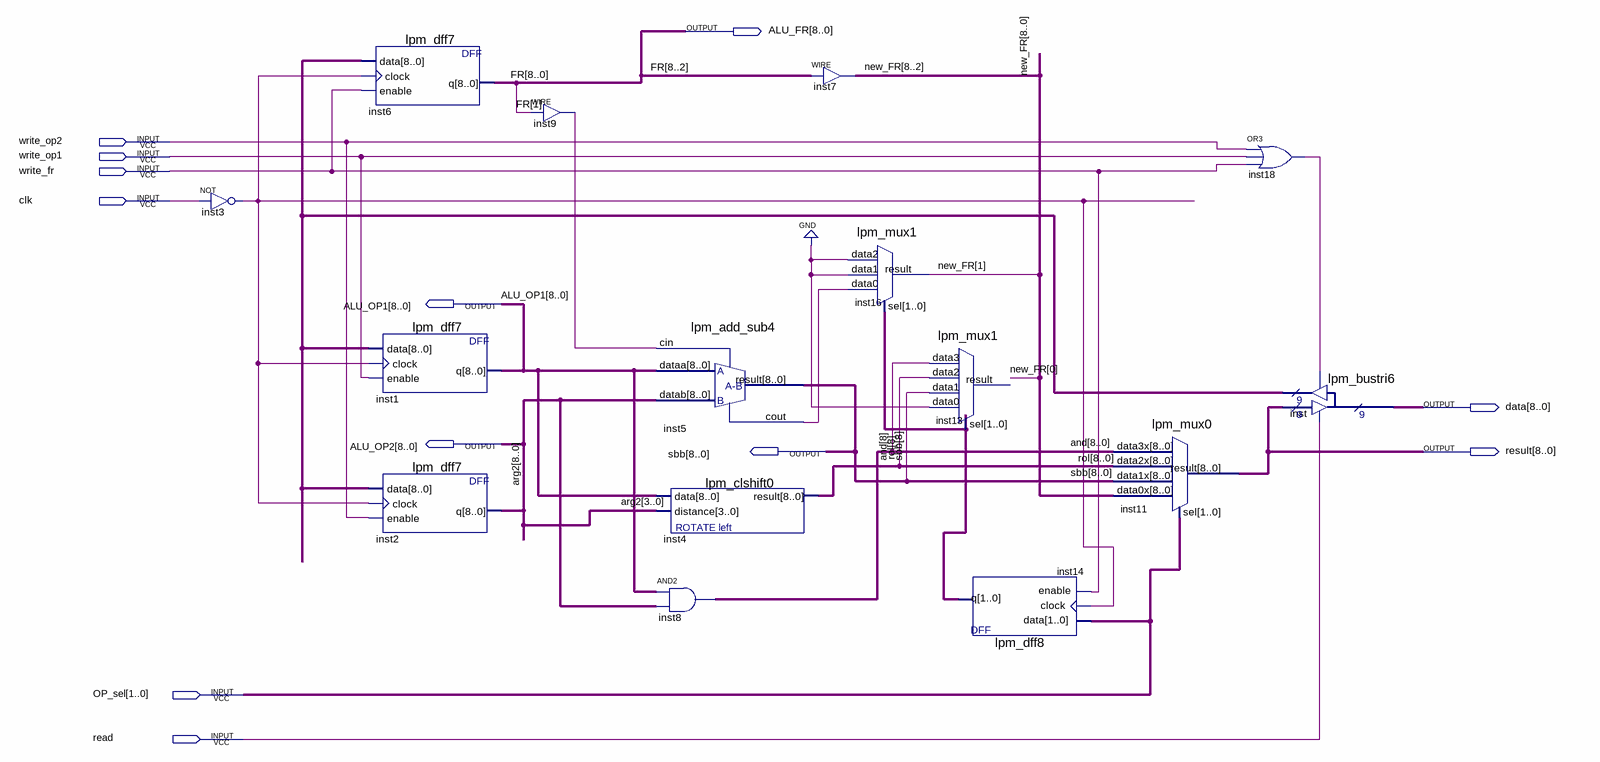
[diagram p0: schematic sheet]
// Quartus schematic alu.bdf as structural Verilog: 15 symbols, 12 pins
module alu (
  input  write_op2,
  input  write_op1,
  input  write_fr,
  input  clk,
  input  [1:0] OP_sel,
  input  read,
  output [8:0] ALU_FR,
  output [8:0] ALU_OP1,
  output [8:0] data,
  output [8:0] ALU_OP2,
  output [8:0] sbb,
  output [8:0] result
);

  wire inst3_out, inst5_cout, inst9_out, inst18_out;
  wire [1:0] inst14_q;
  wire [8:0] \and , inst_result, new_FR, rol;

  not inst3 (inst3_out, clk);
  lpm_dff7 inst6 (.data(inst_result), .clock(inst3_out), .enable(write_fr), .q(ALU_FR));
  lpm_dff7 inst1 (.data(inst_result), .clock(inst3_out), .enable(write_op1), .q(ALU_OP1));
  lpm_dff7 inst2 (.data(inst_result), .clock(inst3_out), .enable(write_op2), .q(ALU_OP2));
  assign inst9_out = ALU_FR[1];  // WIRE inst9
  lpm_add_sub4 inst5 (.dataa(ALU_OP1), .datab(ALU_OP2), .cin(inst9_out), .result(sbb), .cout(inst5_cout));
  lpm_clshift0 inst4 (.data(ALU_OP1), .distance(ALU_OP2[3:0]), .result(rol));
  assign \and  = ALU_OP1 & ALU_OP2;  // AND2 inst8, 9 bits wide
  assign new_FR[8:2] = ALU_FR[8:2];  // WIRE inst7
  lpm_mux1 inst16 (.data2(1'b0), .data1(1'b0), .data0(inst5_cout), .sel(inst14_q), .result(new_FR[1]));
  lpm_mux1 inst13 (.data3(\and [8]), .data2(rol[8]), .data1(sbb[8]), .data0(1'b0), .sel(inst14_q));  // open: result
  lpm_dff8 inst14 (.data(OP_sel), .clock(inst3_out), .enable(write_fr), .q(inst14_q));
  lpm_mux0 inst11 (.data3x(\and ), .data2x(rol), .data1x(sbb), .data0x(new_FR), .sel(OP_sel), .result(result));
  or inst18 (inst18_out, write_op2, write_op1, write_fr);
  lpm_bustri6 inst (.enabledt(read), .data(result), .enabletr(inst18_out), .result(inst_result), .tridata(data));

  // Other names for the same wires on the sheet: FR[8:0] = ALU_FR; arg2[8:0] = ALU_OP2
endmodule
